# Altium schematic sheet Sch_mppt_board.SchDoc
size A4; Organization: Altium Limited; Address1: L3, 12a Rodborough Rd; Address2: Frenchs Forest; Address3: NSW; Address4: Australia 2086
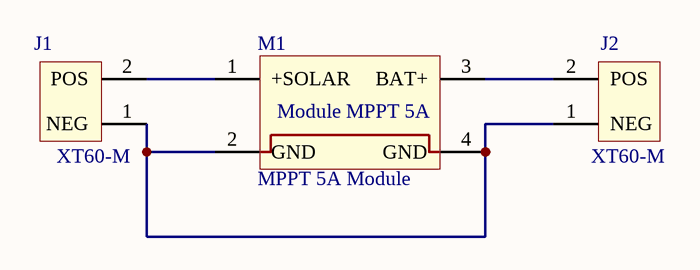
[diagram p0: Sch_mppt_board.SchDoc]

## Parts
J1  XT60-M  [XT60-M]
J2  XT60-M  [XT60-M]
M1  MPPT 5A Module  [MODULE MPPT 5A BQ24650]

## Nets
NetJ1_1: J1.1(NEG) J2.1(NEG) M1.2(GND) M1.4(GND)
NetJ1_2: J1.2(POS) M1.1(+SOLAR)
NetJ2_2: J2.2(POS) M1.3(BAT+)

## Notes on the sheet
- Title
- Size:
- Date:
- A4
- Number:
- Time:
- Revision:
- Sheet
- of
- File:
- (in symbol Module BQ24650 MPPT 5A) Module MPPT 5A

## Library data of the parts
J1 J2 = XT60-M: MF: AMASS; SnapEDA_Link: https://www.snapeda.com/parts/XT60-M/AMASS/view-part/?ref=snap; Price: None; Availability: Unavailable; Package: Package Analog Devices; MP: XT60-M; Value: *
M1 = Module BQ24650 MPPT 5A: Module Solar Charge MPPT 5A